# Altium schematic sheet TP4056电池管理模块.SchDoc
size A4
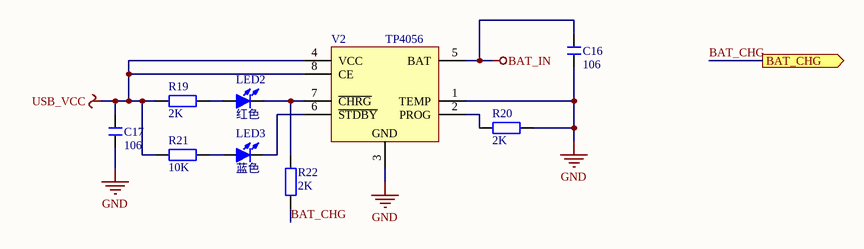
[diagram p0: TP4056电池管理模块.SchDoc]

## Parts
C16  106  [C 0603_L]
C17  106  [C 0603_L]
LED2  红色  [LED 0603R]
LED3  蓝色  [LED 0603B]
R19  2K  [R 0603_L]
R20  2K  [R 0603_L]
R21  10K  [R 0603_L]
R22  2K  [R 0603_L]
V2  TP4056  [SOP8_L]

## Ports
BAT_CHG (out)

## Nets
BAT_IN: C16.1 V2.5(BAT)
GND: C16.2 C17.1 R20.1 V2.1(TEMP) V2.3(GND)
USB_VCC: C17.2 R19.2 R21.2 V2.4(VCC) V2.8(CE)
BAT_CHG: R22.2 ; port BAT_CHG
NetLED2_1: LED2.1(A) R19.1
NetLED2_2: LED2.2(K) R22.1 V2.7(~{CHRG})
NetLED3_1: LED3.1(A) R21.1
NetLED3_2: LED3.2(K) V2.6(~{STDBY})
NetR20_2: R20.2 V2.2(PROG)

## Library data of the parts
C16 C17 = C: 无极性贴片电容; 版权归属: 黎明电子style; BOM名称: 无极性贴片电容; 学习资源: https://lmdzstyle.taobao.com/
LED2 LED3 = LED-SMD: 贴片LED; 版权归属: 源创客; BOM名称: 贴片LED; 学习资源: www.ooocke.com
R19-R22 = R: 贴片电阻; 版权归属: 黎明电子style; BOM名称: 贴片电阻; 学习资源: https://lmdzstyle.taobao.com/
V2 = TP4056: 锂电池充电管理; 版权归属: 源创客; BOM名称: 锂电池充电管理; 学习资源: www.ooocke.com